# EAGLE design R111E (EAGLE 6.6.0)
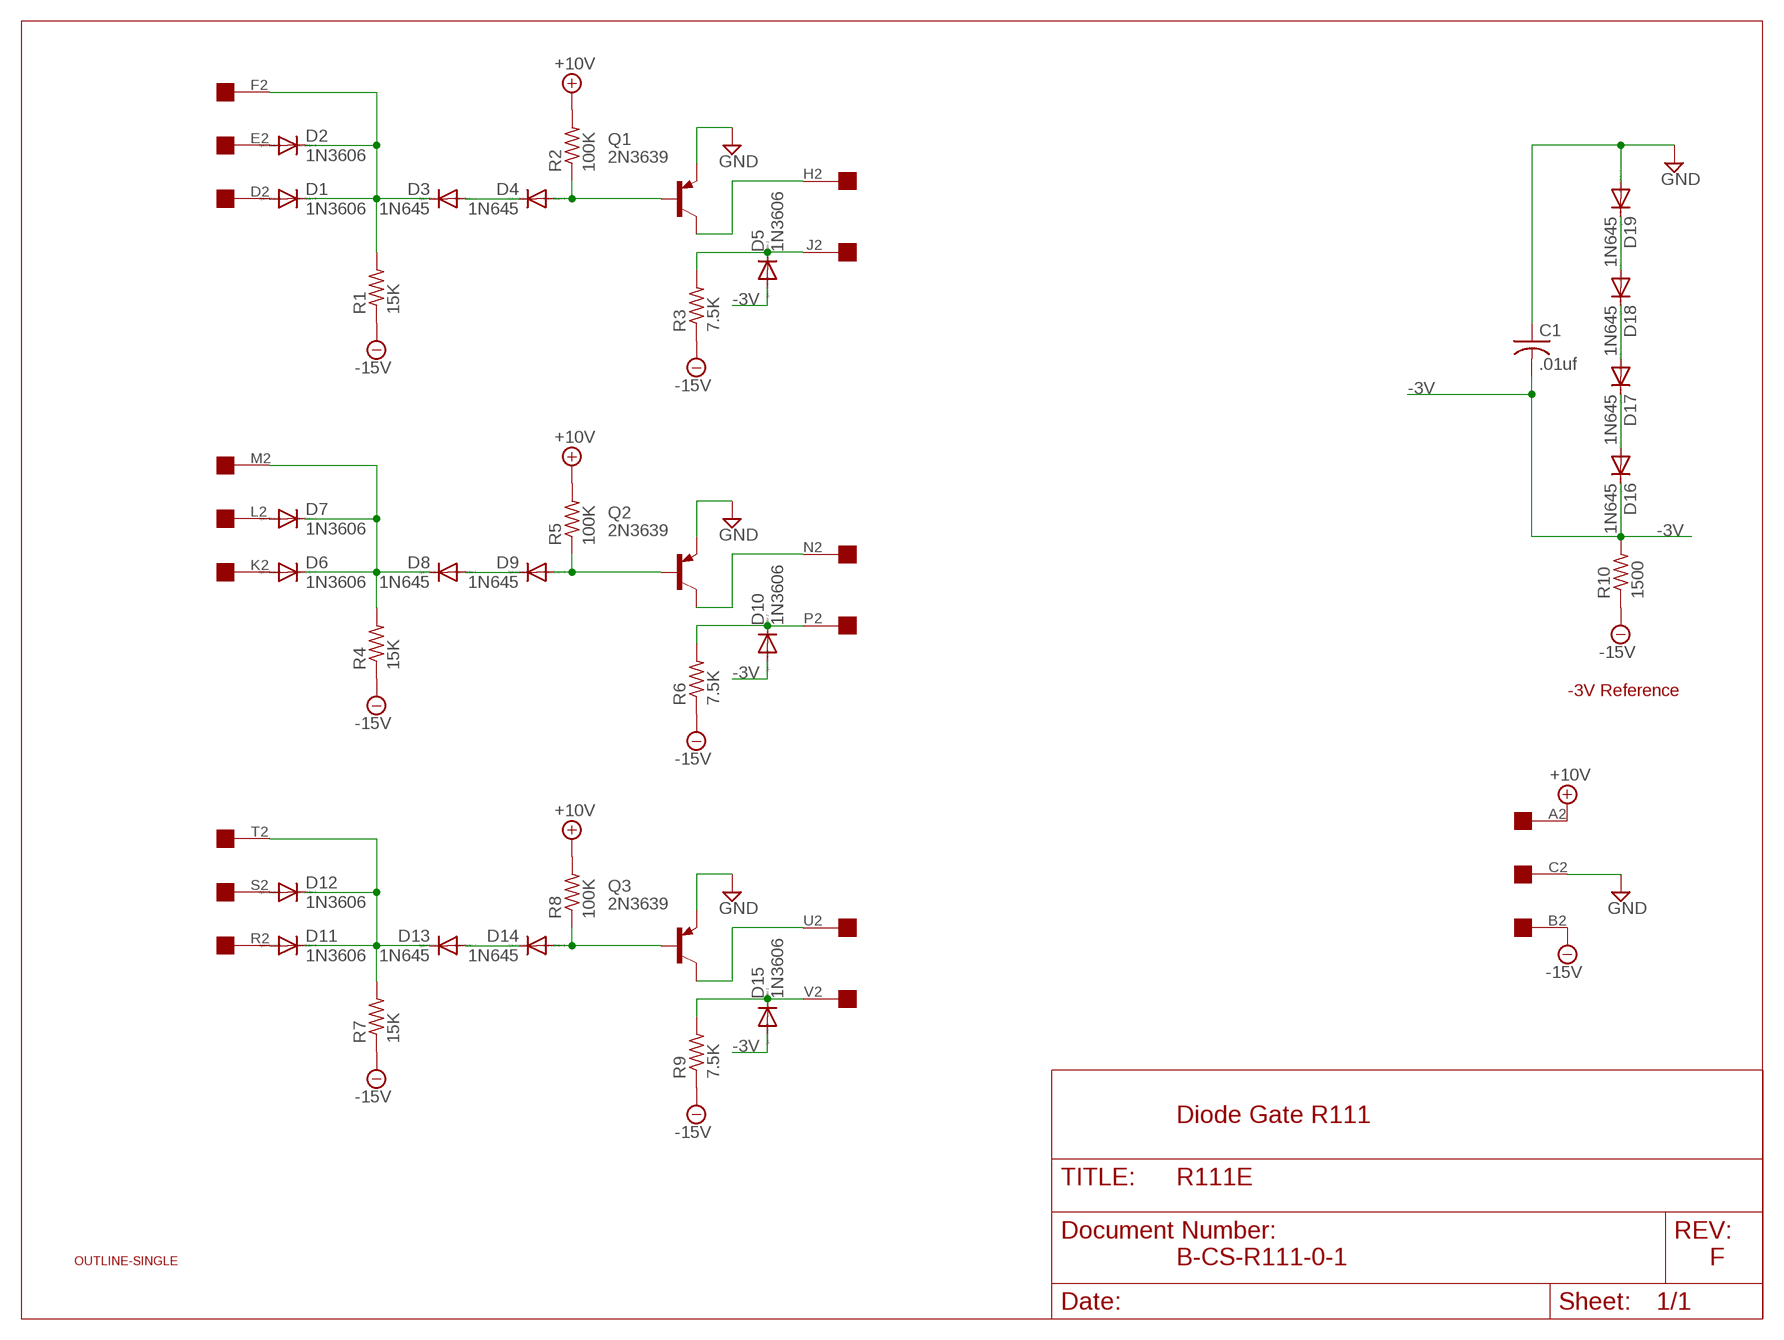
[diagram p0: schematic, sheet 1]

## Parts
C1  .01uf  C-US150-054X183  [C150-054X183]
D1  1N3606  1N4148DO35-10  [DO35-10]
D2  1N3606  1N4148DO35-10  [DO35-10]
D3  1N645  1N4148DO35-10  [DO35-10]
D4  1N645  1N4148DO35-10  [DO35-10]
D5  1N3606  1N4148DO35-10  [DO35-10]
D6  1N3606  1N4148DO35-10  [DO35-10]
D7  1N3606  1N4148DO35-10  [DO35-10]
D8  1N645  1N4148DO35-10  [DO35-10]
D9  1N645  1N4148DO35-10  [DO35-10]
D10  1N3606  1N4148DO35-10  [DO35-10]
D11  1N3606  1N4148DO35-10  [DO35-10]
D12  1N3606  1N4148DO35-10  [DO35-10]
D13  1N645  1N4148DO35-10  [DO35-10]
D14  1N645  1N4148DO35-10  [DO35-10]
D15  1N3606  1N4148DO35-10  [DO35-10]
D16  1N645  1N4148DO35-10  [DO35-10]
D17  1N645  1N4148DO35-10  [DO35-10]
D18  1N645  1N4148DO35-10  [DO35-10]
D19  1N645  1N4148DO35-10  [DO35-10]
Q1  2N3639  2N3637  [TO39]
Q2  2N3639  2N3637  [TO39]
Q3  2N3639  2N3637  [TO39]
R1  15K  R-US_0207/10  [0207/10]
R2  100K  R-US_0207/10  [0207/10]
R3  7.5K  R-US_0207/10  [0207/10]
R4  15K  R-US_0207/10  [0207/10]
R5  100K  R-US_0207/10  [0207/10]
R6  7.5K  R-US_0207/10  [0207/10]
R7  15K  R-US_0207/10  [0207/10]
R8  100K  R-US_0207/10  [0207/10]
R9  7.5K  R-US_0207/10  [0207/10]
R10  1500  R-US_0207/10  [0207/10]
U$1  OUTLINE-SINGLE  [SINGLE]
U$2  EDGE-1  [EDGE-CON1]

## Nets
+10V [Power]: R2.2 R5.2 R8.2 U$2.A2
-3V [Power]: C1.2 D5.A D10.A D15.A D16.C R10.2
-15V [Power]: R1.1 R3.1 R4.1 R6.1 R7.1 R9.1 R10.1 U$2.B2
GND [Power]: C1.1 D19.A Q1.1(E) Q2.1(E) Q3.1(E) U$2.C2
N$1: D6.A U$2.K2
N$2: D9.A Q2.2(B) R5.1
N$3: D18.A D19.C
N$4: D10.C R6.2 U$2.P2
N$5: Q1.3(C) U$2.H2
N$6: D6.C D7.C D8.C R4.2 U$2.M2
N$7: D8.A D9.C
N$8: D14.A Q3.2(B) R8.1
N$9: D15.C R9.2 U$2.V2
N$10: D11.A U$2.R2
N$11: D11.C D12.C D13.C R7.2 U$2.T2
N$12: D13.A D14.C
N$13: D17.A D18.C
N$14: D7.A U$2.L2
N$15: Q2.3(C) U$2.N2
N$16: D16.A D17.C
N$17: Q3.3(C) U$2.U2
N$19: D4.A Q1.2(B) R2.1
N$20: D5.C R3.2 U$2.J2
N$21: D1.A U$2.D2
N$22: D1.C D2.C D3.C R1.2 U$2.F2
N$23: D3.A D4.C
N$31: D12.A U$2.S2
N$39: D2.A U$2.E2

## Notes on the sheet
- -3V Reference
- Diode Gate R111
- B-CS-R111-0-1 | F

## Library data of the parts
C1 = rcl:C-US: CAPACITOR, American symbol
D1-D19 = diode:1N4148: DIODE high speed (Philips)
Q1-Q3 = transistor-pnp:2N3637*: PNP Transistror
R1-R10 = rcl:R-US_: RESISTOR, American symbol
U$1 = dec-con:OUTLINE-*: Board outlines for DEC boards.
U$2 = dec-con:EDGE-1: Single-Sided DEC Edge Connector -- (side 2)

## Net classes
1 Power: width 0.813 mm

## Board
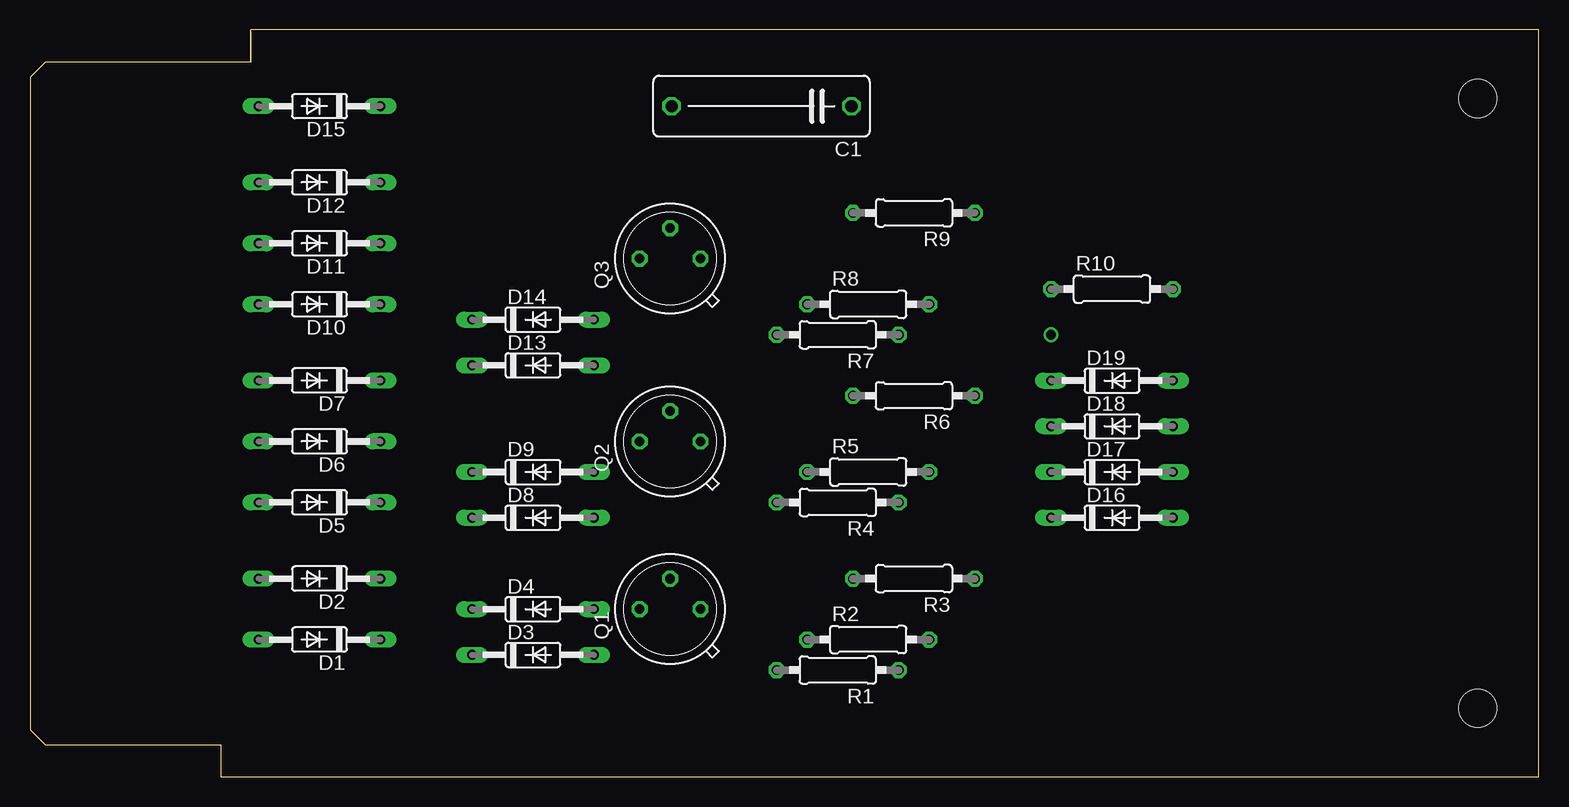
[diagram p1: board, top side]
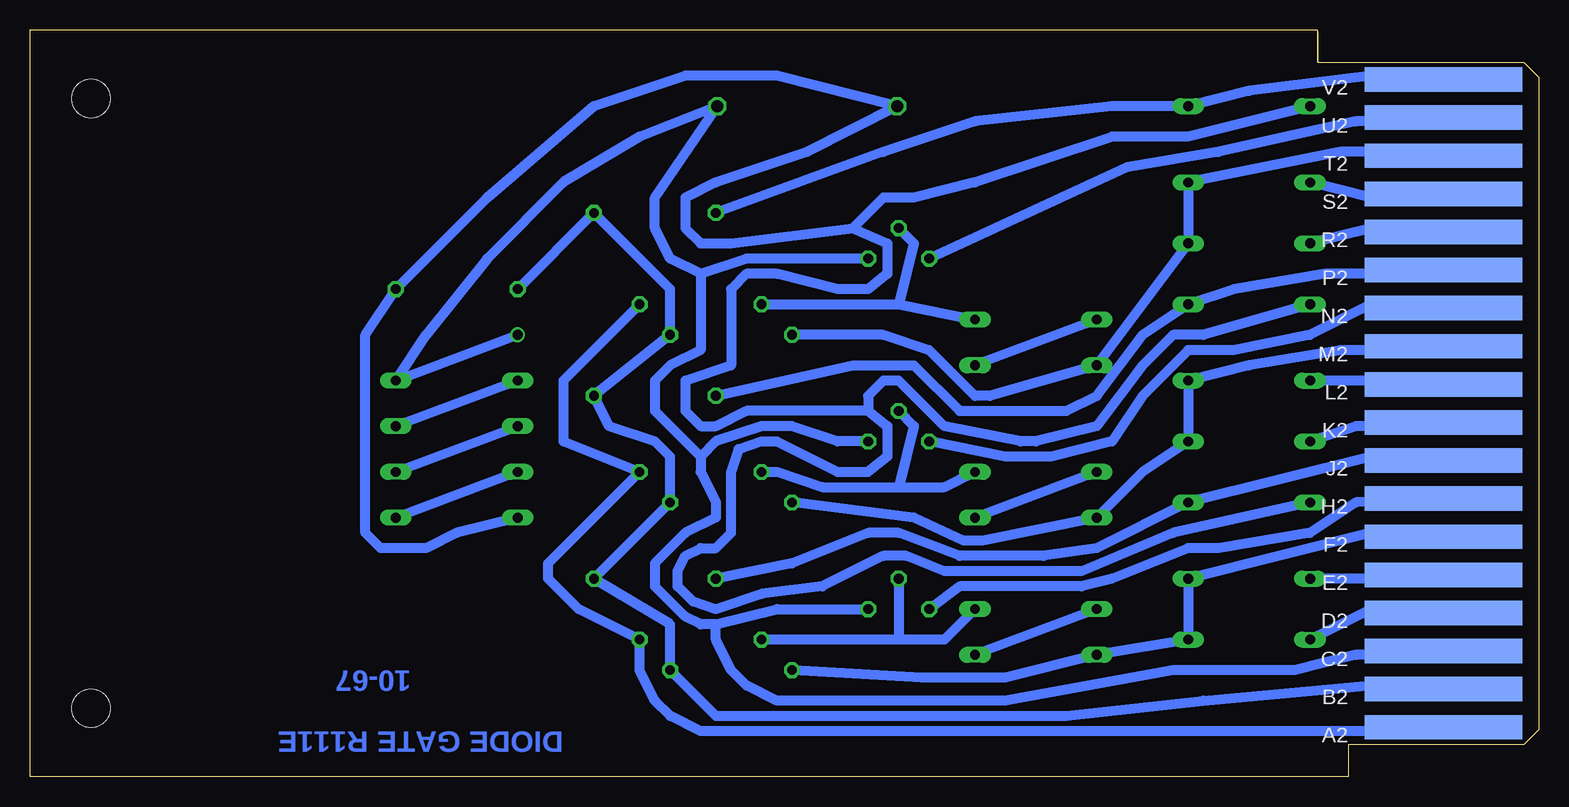
[diagram p2: board, bottom side, seen from below]

Size 125.73 x 62.23 mm. Coordinates in mm from the lower left corner, seen from the top.
Copper layers (1+16): Top 0.035mm / dielectric 1.5mm / Bottom 0.035mm
Design rules "16mils": minimum track width 16mil, minimum drill 32mil, track to track 15mil, track to pad 10mil, pad to pad 10mil, via to via 10mil, smd to smd 10mil, copper to edge 13mil, drill to drill 10mil, minimum pad ring 10mil, minimum via ring 8mil, stop-mask expansion 0mil, vias tented up to drill 0mil, thermal gap 10mil

### Footprints (pad centres in the part's own frame; a part is rotated, then mirrored left to right if it is on the bottom)
C150-054X183 = drill 1.016 octagon: 1 -7.493,0; 2 7.493,0
DO35-10 = drill 0.813 long: A 5.08,0; C -5.08,0
TO39 = drill 0.813 octagon: 1 0,-2.54; 2 2.54,0; 3 0,2.54
0207/10 = drill 0.813 octagon: 1 -5.08,0; 2 5.08,0
SINGLE = hole 3.175: 120.65,56.515; 120.65,5.715
EDGE-CON1 = smd 13.106 x 2.032 bottom: A2 7.938,4.128; B2 7.938,7.303; C2 7.938,10.477; D2 7.938,13.652; E2 7.938,16.828; F2 7.938,20.003; H2 7.938,23.177; J2 7.938,26.352; K2 7.938,29.527; L2 7.938,32.703; M2 7.938,35.877; N2 7.938,39.053; P2 7.938,42.227; R2 7.938,45.403; S2 7.938,48.578; T2 7.938,51.752; U2 7.938,54.928; V2 7.938,58.102

### Placement (x,y rotation side)
C1  60.96,55.88 180 top
D1  24.13,11.43 180 top
D2  24.13,16.51 180 top
D3  41.91,10.16 0 top
D4  41.91,13.97 0 top
D5  24.13,22.86 180 top
D6  24.13,27.94 180 top
D7  24.13,33.02 180 top
D8  41.91,21.59 0 top
D9  41.91,25.4 0 top
D10  24.13,39.37 180 top
D11  24.13,44.45 180 top
D12  24.13,49.53 180 top
D13  41.91,34.29 0 top
D14  41.91,38.1 0 top
D15  24.13,55.88 180 top
D16  90.17,21.59 0 top
D17  90.17,25.4 0 top
D18  90.17,29.21 0 top
D19  90.17,33.02 0 top
Q1  53.34,13.97 90 top
Q2  53.34,27.94 90 top
Q3  53.34,43.18 90 top
R1  67.31,8.89 180 top
R2  69.85,11.43 0 top
R3  73.66,16.51 180 top
R4  67.31,22.86 180 top
R5  69.85,25.4 0 top
R6  73.66,31.75 180 top
R7  67.31,36.83 180 top
R8  69.85,39.37 0 top
R9  73.66,46.99 180 top
R10  90.17,40.64 0 top
U$1  0,0 0 top
U$2  0,0 0 top

### Tracks (layer width: path | path; a pad name or v marks a point on that pad's centre or on a via)
+10V
  Bottom 0.813: U$2.A2 8.89,4.13 8.89,3.81 69.85,3.81 72.39,5.08 73.66,6.35 74.93,8.89 R2.2 80.01,13.97 82.55,16.51 82.55,17.78 R5.2 81.28,27.94 81.28,33.02 R8.2
-3V
  Bottom 0.813: D5.A 30.48,20.32 38.1,17.14 49.53,17.14 52.71,18.41 54.61,18.41 59.69,15.88 64.77,15.24 68.58,13.97 70.49,14.61 71.76,15.88 71.76,17.14 71.12,18.41 69.85,19.05 68.58,19.05 67.31,20.32 67.31,25.4 66.68,27.3 64.77,27.94 63.5,27.94 58.42,25.4 55.88,25.4 54.29,26.67 54.29,29.21 55.88,30.48 | 55.88,30.48 66.04,30.48 68.58,29.21 69.85,29.21 71.12,30.48 71.12,33.02 67.31,34.29 67.31,40.64 66.04,41.91 63.5,41.91 58.42,40.64 55.88,40.64 54.29,41.91 54.29,44.45 57.15,45.72 | D16.C 90.17,20.32 92.71,19.05 96.52,19.05 97.79,20.32 97.79,36.83 R10.2 87.63,48.26 78.74,55.88 71.12,58.42 63.5,58.42 C1.2 60.96,52.07 68.58,49.53 71.12,48.26 71.12,45.72 69.85,44.45 67.31,44.45 57.15,45.72 | D15.A 29.21,53.34 35.56,53.34 46.99,49.53 52.07,48.26 54.61,48.26 57.15,45.72 | D10.A 27.94,36.83 30.48,36.83 33.02,34.29 36.83,29.21 41.91,27.94 43.18,27.94 49.53,29.21 53.34,33.02 54.61,33.02 55.88,31.75 55.88,30.48
-15V
  Bottom 0.813: U$2.B2 13.97,7.62 27.94,6.35 39.37,5.08 68.58,5.08 R1.1 72.39,12.7 R3.1 R4.1 72.39,26.67 73.66,27.94 77.47,29.21 R6.1 R7.1 72.39,40.64 R9.1 R10.1
GND  (via drill 0.81)
  Bottom 0.813: U$2.C2 8.89,10.16 15.24,10.16 20.32,8.89 30.48,8.89 44.45,6.35 63.5,6.35 66.04,7.62 67.31,8.89 68.58,11.43 68.58,12.7 | 68.58,12.7 63.5,13.97 Q1.1 | Q2.1 58.42,27.94 62.23,29.21 64.77,29.21 68.58,27.94 69.85,26.67 | 69.85,26.67 69.85,25.4 68.58,22.86 68.58,21.59 71.12,20.32 73.66,17.78 73.66,15.88 71.12,13.34 69.85,12.7 68.58,12.7 | v85.09,36.83 D19.A 92.71,36.83 87.63,43.18 81.28,49.53 74.93,53.34 C1.1 73.66,48.26 73.66,45.72 72.39,43.18 69.85,41.91 | Q3.1 66.04,43.18 69.85,41.91 | 69.85,41.91 69.85,35.56 72.39,34.29 73.66,33.02 73.66,30.48 69.85,26.67
N$1
  Bottom 0.813: U$2.K2 10.16,29.21 15.24,29.21 D6.A
N$2
  Bottom 0.813: Q2.2 52.07,29.21 53.34,24.13 | D9.A 49.53,24.13 53.34,24.13 | R5.1 63.5,25.4 59.69,24.13 53.34,24.13
N$3
  Bottom 0.813: D19.C D18.A
N$4
  Bottom 0.813: U$2.P2 8.89,41.91 17.78,41.91 25.4,40.64 D10.C 33.02,36.83 36.83,31.75 39.37,30.48 48.26,30.48 52.07,34.29 57.15,34.29 R6.2
N$5
  Bottom 0.813: U$2.H2 15.24,22.86 19.05,20.32 26.67,19.05 29.21,19.05 35.56,16.51 38.1,15.88 48.26,15.88 Q1.3
N$6
  Bottom 0.813: R4.2 52.07,21.59 47.94,19.68 46.36,19.68 D8.C 33.02,25.4 D6.C D7.C 24.13,34.29 16.51,35.56 11.43,35.56 U$2.M2
N$7
  Bottom 0.813: D9.C D8.A
N$8
  Bottom 0.813: Q3.2 52.07,44.45 53.34,39.37 | 53.34,39.37 D14.A | R8.1 53.34,39.37
N$9
  Bottom 0.813: R9.2 54.61,52.07 46.99,54.61 35.56,55.88 D15.C 24.13,57.15 13.97,58.42 8.89,58.42 U$2.V2
N$10
  Bottom 0.813: U$2.R2 8.89,45.72 13.97,45.72 D11.A
N$11
  Bottom 0.813: U$2.T2 8.89,52.07 16.51,52.07 D12.C D11.C D13.C 45.72,31.75 46.99,31.75 50.8,35.56 54.61,36.83 R7.2
N$12
  Bottom 0.813: D14.C D13.A
N$13
  Bottom 0.813: D17.A D18.C
N$14
  Bottom 0.813: U$2.L2 8.89,33.02 D7.A
N$15
  Bottom 0.813: U$2.N2 7.62,39.37 13.97,39.37 19.05,36.83 25.4,35.56 29.21,35.56 33.02,31.75 35.56,27.94 40.64,26.67 44.45,26.67 Q2.3
N$16
  Bottom 0.813: D17.C D16.A
N$17
  Bottom 0.813: U$2.U2 13.97,54.61 15.24,54.61 26.67,52.07 34.29,50.8 Q3.3
N$19
  Bottom 0.813: Q1.2 53.34,11.43 | 53.34,11.43 R2.1 | D4.A 49.53,11.43 53.34,11.43
N$20
  Bottom 0.813: U$2.J2 8.89,26.67 13.97,26.67 D5.C 36.83,19.05 41.28,18.41 48.26,18.41 53.34,20.32 55.88,20.32 62.23,17.78 R3.2
N$21
  Bottom 0.813: U$2.D2 13.97,13.97 D1.A
N$22
  Bottom 0.813: R1.2 51.44,8.26 44.45,8.26 D3.C D1.C D2.C 13.97,20.32 U$2.F2
N$23
  Bottom 0.813: D4.C D3.A
N$31
  Bottom 0.813: U$2.S2 8.89,48.26 13.97,48.26 D12.A
N$39
  Bottom 0.813: U$2.E2 13.97,16.51 D2.A

### Text on the board
Bottom: 10-67 | DIODE GATE R111E